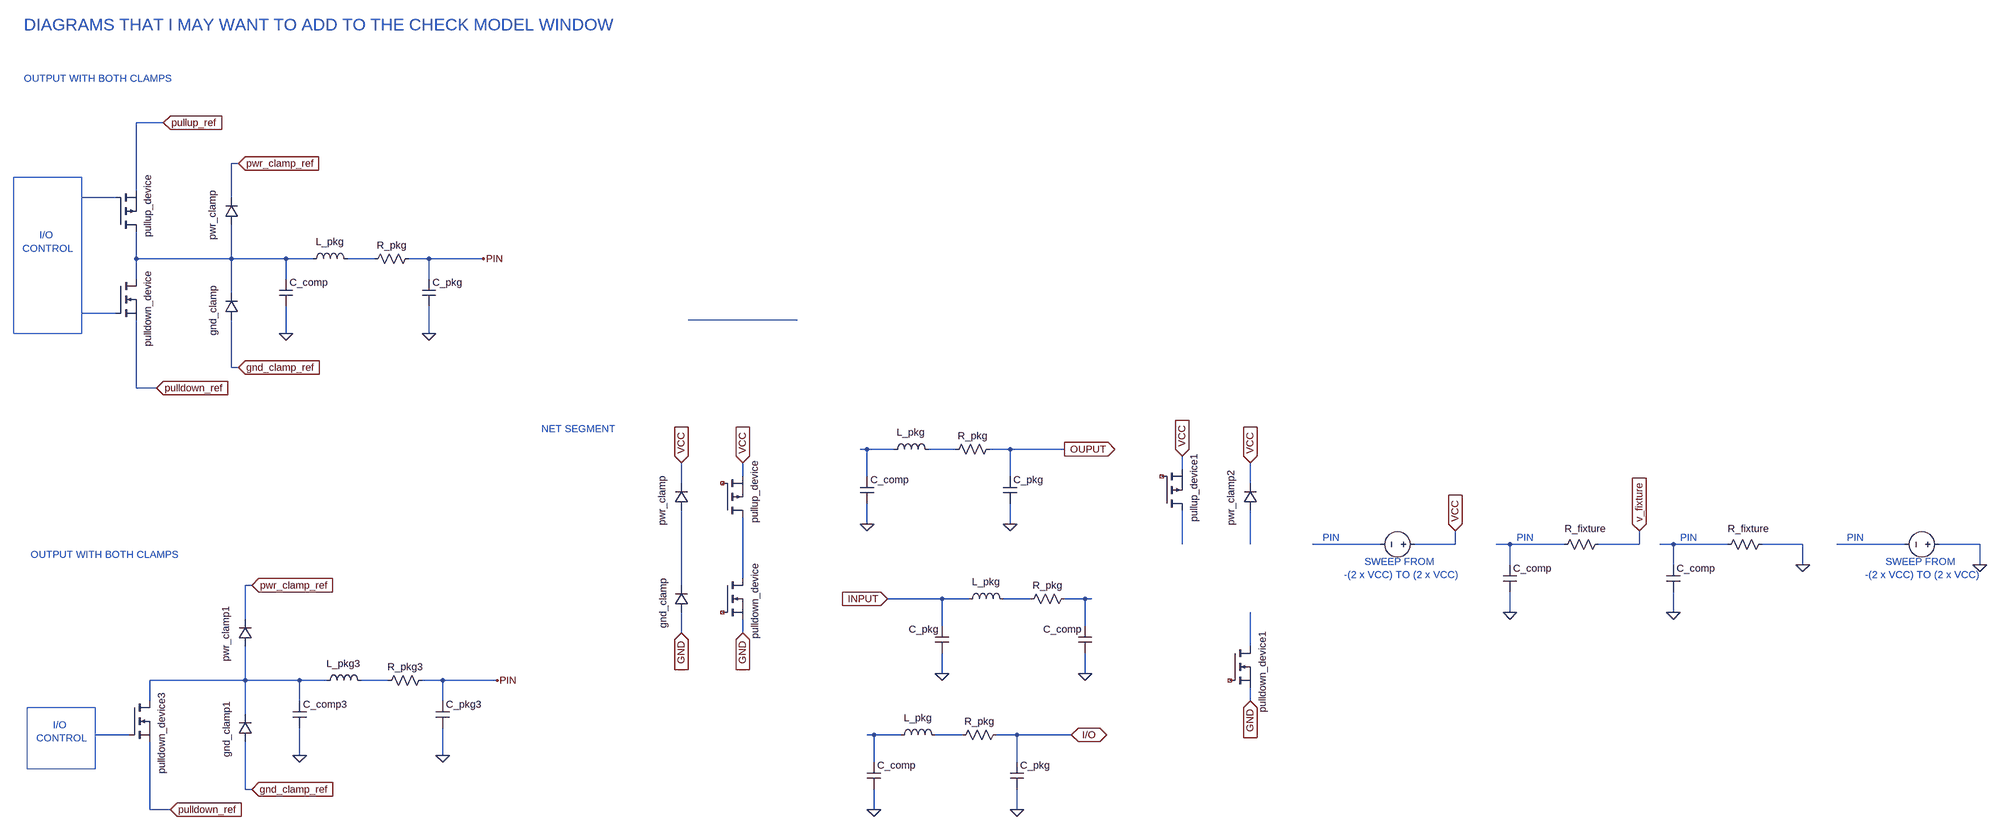
[diagram p0: schematic circuit_diagrams.asc]
circuit_diagrams.asc, the LTspice schematic file:
Version 4
SHEET 1 6020 1700
WIRE -256 -160 -320 -160
WIRE -80 -64 -96 -64
WIRE -320 0 -320 -160
WIRE -368 16 -448 16
WIRE -96 16 -96 -64
WIRE -320 160 -320 96
WIRE -96 160 -96 80
WIRE -96 160 -320 160
WIRE 32 160 -96 160
WIRE 96 160 32 160
WIRE 240 160 176 160
WIRE 368 160 320 160
WIRE 496 160 368 160
WIRE -320 208 -320 160
WIRE 32 208 32 160
WIRE 368 208 368 160
WIRE -96 240 -96 160
WIRE -368 288 -448 288
WIRE 2640 304 2384 304
WIRE 32 336 32 272
WIRE 368 336 368 272
WIRE -96 416 -96 304
WIRE -80 416 -96 416
WIRE -320 464 -320 304
WIRE -272 464 -320 464
WIRE 2864 608 2848 608
WIRE 2928 608 2864 608
WIRE 3072 608 3008 608
WIRE 3200 608 3152 608
WIRE 3328 608 3200 608
WIRE 3856 656 3856 624
WIRE 2512 672 2512 640
WIRE 2864 672 2864 608
WIRE 3200 672 3200 608
WIRE 2368 688 2368 640
WIRE 4016 688 4016 640
WIRE 2864 784 2864 736
WIRE 3200 784 3200 736
WIRE 3856 832 3856 752
WIRE 4016 832 4016 752
WIRE 4592 832 4432 832
WIRE 4768 832 4768 800
WIRE 4768 832 4672 832
WIRE 4896 832 4864 832
WIRE 5024 832 4896 832
WIRE 5200 832 5200 800
WIRE 5200 832 5104 832
WIRE 5280 832 5248 832
WIRE 5408 832 5280 832
WIRE 5584 832 5488 832
WIRE 5824 832 5664 832
WIRE 6000 832 5904 832
WIRE 4896 880 4896 832
WIRE 5280 880 5280 832
WIRE 5584 880 5584 832
WIRE 6000 880 6000 832
WIRE 2512 912 2512 768
WIRE -48 928 -64 928
WIRE 2368 928 2368 752
WIRE 3040 960 2912 960
WIRE 3104 960 3040 960
WIRE 3248 960 3184 960
WIRE 3376 960 3328 960
WIRE 3392 960 3376 960
WIRE 4896 992 4896 944
WIRE 5280 992 5280 944
WIRE -64 1008 -64 928
WIRE 3040 1024 3040 960
WIRE 3376 1024 3376 960
WIRE 2368 1040 2368 992
WIRE 2512 1040 2512 1008
WIRE 4016 1072 4016 992
WIRE 3040 1136 3040 1088
WIRE 3376 1136 3376 1088
WIRE -64 1152 -64 1072
WIRE -64 1152 -288 1152
WIRE 64 1152 -64 1152
WIRE 128 1152 64 1152
WIRE 272 1152 208 1152
WIRE 400 1152 352 1152
WIRE 528 1152 400 1152
WIRE -288 1200 -288 1152
WIRE 64 1200 64 1152
WIRE 400 1200 400 1152
WIRE 4016 1200 4016 1168
WIRE -64 1232 -64 1152
WIRE -336 1280 -416 1280
WIRE 2880 1280 2864 1280
WIRE 2944 1280 2880 1280
WIRE 3088 1280 3024 1280
WIRE 3216 1280 3168 1280
WIRE 3344 1280 3216 1280
WIRE -416 1328 -416 1280
WIRE 64 1328 64 1264
WIRE 400 1328 400 1264
WIRE 2880 1344 2880 1280
WIRE 3216 1344 3216 1280
WIRE -64 1408 -64 1296
WIRE -48 1408 -64 1408
WIRE -288 1456 -288 1296
WIRE -240 1456 -288 1456
WIRE 2880 1456 2880 1408
WIRE 3216 1456 3216 1408
FLAG 368 336 0
FLAG 32 336 0
FLAG 496 160 PIN
FLAG -256 -160 pullup_ref
IOPIN -256 -160 In
FLAG -272 464 pulldown_ref
IOPIN -272 464 In
FLAG -80 -64 pwr_clamp_ref
IOPIN -80 -64 In
FLAG -80 416 gnd_clamp_ref
IOPIN -80 416 In
FLAG 400 1328 0
FLAG 64 1328 0
FLAG 528 1152 PIN
FLAG -240 1456 pulldown_ref
IOPIN -240 1456 In
FLAG -48 928 pwr_clamp_ref
IOPIN -48 928 In
FLAG -48 1408 gnd_clamp_ref
IOPIN -48 1408 In
FLAG 3200 784 0
FLAG 2864 784 0
FLAG 3328 608 OUPUT
IOPIN 3328 608 Out
FLAG 3376 1136 0
FLAG 3040 1136 0
FLAG 2912 960 INPUT
IOPIN 2912 960 In
FLAG 2368 640 VCC
IOPIN 2368 640 In
FLAG 2368 1040 GND
IOPIN 2368 1040 In
FLAG 2512 640 VCC
IOPIN 2512 640 In
FLAG 2512 1040 GND
IOPIN 2512 1040 In
FLAG 3216 1456 0
FLAG 2880 1456 0
FLAG 3344 1280 I/O
IOPIN 3344 1280 BiDir
FLAG 3856 624 VCC
IOPIN 3856 624 In
FLAG 4016 1200 GND
IOPIN 4016 1200 In
FLAG 4768 800 VCC
IOPIN 4768 800 In
FLAG 4016 640 VCC
IOPIN 4016 640 In
FLAG 6000 880 0
FLAG 5200 800 v_fixture
IOPIN 5200 800 In
FLAG 5584 880 0
FLAG 4896 992 0
FLAG 5280 992 0
SYMBOL ind 80 176 R270
WINDOW 0 40 55 VTop 2
WINDOW 3 5 56 VBottom 2
SYMATTR InstName L_pkg
SYMATTR Value ""
SYMBOL res 336 144 R90
WINDOW 0 0 56 VBottom 2
WINDOW 3 32 56 VTop 2
SYMATTR InstName R_pkg
SYMATTR Value ""
SYMBOL cap 352 208 R0
SYMATTR InstName C_pkg
SYMATTR Value ""
SYMBOL cap 16 208 R0
SYMATTR InstName C_comp
SYMATTR Value ""
SYMBOL diode -80 80 R180
WINDOW 0 61 -36 VRight 2
WINDOW 3 24 0 Left 2
SYMATTR InstName pwr_clamp
SYMATTR Value ""
SYMBOL diode -80 304 R180
WINDOW 0 59 -37 VRight 2
WINDOW 3 24 0 Left 2
SYMATTR InstName gnd_clamp
SYMATTR Value ""
SYMBOL nmos -368 208 R0
WINDOW 0 76 -20 VRight 2
SYMATTR InstName pulldown_device
SYMATTR Value ""
SYMBOL pmos -368 96 M180
WINDOW 0 76 134 VLeft 2
SYMATTR InstName pullup_device
SYMATTR Value ""
SYMBOL ind 112 1168 R270
WINDOW 0 40 55 VTop 2
WINDOW 3 5 56 VBottom 2
SYMATTR InstName L_pkg3
SYMATTR Value ""
SYMBOL res 368 1136 R90
WINDOW 0 0 56 VBottom 2
WINDOW 3 32 56 VTop 2
SYMATTR InstName R_pkg3
SYMATTR Value ""
SYMBOL cap 384 1200 R0
SYMATTR InstName C_pkg3
SYMATTR Value ""
SYMBOL cap 48 1200 R0
SYMATTR InstName C_comp3
SYMATTR Value ""
SYMBOL diode -48 1072 R180
WINDOW 0 61 -36 VRight 2
WINDOW 3 24 0 Left 2
SYMATTR InstName pwr_clamp1
SYMATTR Value ""
SYMBOL diode -48 1296 R180
WINDOW 0 59 -37 VRight 2
WINDOW 3 24 0 Left 2
SYMATTR InstName gnd_clamp1
SYMATTR Value ""
SYMBOL nmos -336 1200 R0
WINDOW 0 76 -20 VRight 2
SYMATTR InstName pulldown_device3
SYMATTR Value ""
SYMBOL ind 2912 624 R270
WINDOW 0 40 55 VTop 2
WINDOW 3 5 56 VBottom 2
SYMATTR InstName L_pkg
SYMATTR Value ""
SYMBOL res 3168 592 R90
WINDOW 0 0 56 VBottom 2
WINDOW 3 32 56 VTop 2
SYMATTR InstName R_pkg
SYMATTR Value ""
SYMBOL cap 3184 672 R0
SYMATTR InstName C_pkg
SYMATTR Value ""
SYMBOL cap 2848 672 R0
SYMATTR InstName C_comp
SYMATTR Value ""
SYMBOL ind 3088 976 R270
WINDOW 0 40 55 VTop 2
WINDOW 3 5 56 VBottom 2
SYMATTR InstName L_pkg
SYMATTR Value ""
SYMBOL res 3344 944 R90
WINDOW 0 0 56 VBottom 2
WINDOW 3 32 56 VTop 2
SYMATTR InstName R_pkg
SYMATTR Value ""
SYMBOL cap 3056 1024 M0
SYMATTR InstName C_pkg
SYMATTR Value ""
SYMBOL cap 3392 1024 M0
SYMATTR InstName C_comp
SYMATTR Value ""
SYMBOL diode 2384 752 R180
WINDOW 0 61 -36 VRight 2
WINDOW 3 24 0 Left 2
SYMATTR InstName pwr_clamp
SYMATTR Value ""
SYMBOL diode 2384 992 R180
WINDOW 0 59 -37 VRight 2
WINDOW 3 24 0 Left 2
SYMATTR InstName gnd_clamp
SYMATTR Value ""
SYMBOL nmos 2464 912 R0
WINDOW 0 77 -36 VRight 2
SYMATTR InstName pulldown_device
SYMATTR Value ""
SYMBOL pmos 2464 768 M180
WINDOW 0 76 134 VLeft 2
SYMATTR InstName pullup_device
SYMATTR Value ""
SYMBOL ind 2928 1296 R270
WINDOW 0 40 55 VTop 2
WINDOW 3 5 56 VBottom 2
SYMATTR InstName L_pkg
SYMATTR Value ""
SYMBOL res 3184 1264 R90
WINDOW 0 0 56 VBottom 2
WINDOW 3 32 56 VTop 2
SYMATTR InstName R_pkg
SYMATTR Value ""
SYMBOL cap 3200 1344 R0
SYMATTR InstName C_pkg
SYMATTR Value ""
SYMBOL cap 2864 1344 R0
SYMATTR InstName C_comp
SYMATTR Value ""
SYMBOL pmos 3808 752 M180
WINDOW 0 76 134 VLeft 2
SYMATTR InstName pullup_device1
SYMATTR Value ""
SYMBOL nmos 3968 1072 R0
WINDOW 0 77 -36 VRight 2
SYMATTR InstName pulldown_device1
SYMATTR Value ""
SYMBOL voltage 4688 832 R90
WINDOW 0 -32 56 Invisible 2
WINDOW 3 32 56 Invisible 2
SYMATTR InstName V1
SYMBOL diode 4032 752 R180
WINDOW 0 61 -36 VRight 2
WINDOW 3 24 0 Left 2
SYMATTR InstName pwr_clamp2
SYMATTR Value ""
SYMBOL voltage 5920 832 R90
WINDOW 0 -32 56 Invisible 2
WINDOW 3 32 56 Invisible 2
SYMATTR InstName V2
SYMBOL res 5120 816 R90
WINDOW 0 -21 -1 VRight 2
WINDOW 3 32 56 Invisible 2
SYMATTR InstName R_fixture
SYMBOL cap 4880 880 R0
SYMATTR InstName C_comp
SYMATTR Value ""
SYMBOL res 5504 816 R90
WINDOW 0 -21 -1 VRight 2
WINDOW 3 32 56 Invisible 2
SYMATTR InstName R_fixture
SYMBOL cap 5264 880 R0
SYMATTR InstName C_comp
SYMATTR Value ""
TEXT -528 120 Center 2 ;I/O \nCONTROL
TEXT -584 -264 Left 2 ;OUTPUT WITH BOTH CLAMPS
TEXT -496 1272 Center 2 ;I/O \nCONTROL
TEXT -568 856 Left 2 ;OUTPUT WITH BOTH CLAMPS
TEXT -584 -504 Left 4 ;DIAGRAMS THAT I MAY WANT TO ADD TO THE CHECK MODEL WINDOW
TEXT 632 560 Left 2 ;NET SEGMENT
TEXT 4640 888 Center 2 ;SWEEP FROM \n-(2 x VCC) TO (2 x VCC)
TEXT 5864 888 Center 2 ;SWEEP FROM \n-(2 x VCC) TO (2 x VCC)
TEXT 5688 816 Left 2 ;PIN
TEXT 5296 816 Left 2 ;PIN
TEXT 4912 816 Left 2 ;PIN
TEXT 4456 816 Left 2 ;PIN
RECTANGLE Normal -448 336 -608 -32
RECTANGLE Normal -416 1360 -576 1216

The netlist it stands for:
* circuit_diagrams.asc
L_pkg N002 N003
R_pkg PIN N003
C_pkg PIN 0
C_comp N002 0
D§pwr_clamp N002 pwr_clamp_ref
D§gnd_clamp gnd_clamp_ref N002
M§pulldown_device N002 N004 pulldown_ref pulldown_ref
M§pullup_device N002 N001 pullup_ref pullup_ref
L_pkg3 N019 N020
R_pkg3 PIN N020
C_pkg3 PIN 0
C_comp3 N019 0
D§pwr_clamp1 N019 pwr_clamp_ref
D§gnd_clamp1 gnd_clamp_ref N019
M§pulldown_device3 N019 N021 pulldown_ref pulldown_ref
L_pkg N006 N007
R_pkg OUPUT N007
C_pkg OUPUT 0
C_comp N006 0
L_pkg INPUT N016
R_pkg N017 N016
C_pkg INPUT 0
C_comp N017 0
D§pwr_clamp N015 VCC
D§gnd_clamp GND N015
M§pulldown_device N014 NC_01 GND GND
M§pullup_device N014 NC_02 VCC VCC
L_pkg N022 N023
R_pkg I/O N023
C_pkg I/O 0
C_comp N022 0
M§pullup_device1 N008 NC_03 VCC VCC
M§pulldown_device1 N018 NC_04 GND GND
V1 VCC N010 V
D§pwr_clamp2 N009 VCC
V2 0 N013 V
R_fixture v_fixture N011 R
C_comp N011 0
R_fixture 0 N012 R
C_comp N012 0
.model D D
.lib standard.dio
.model NMOS NMOS
.model PMOS PMOS
.lib standard.mos
* I/O
* CONTROL
* OUTPUT WITH BOTH CLAMPS
* I/O
* CONTROL
* OUTPUT WITH BOTH CLAMPS
* DIAGRAMS THAT I MAY WANT TO ADD TO THE CHECK MODEL WINDOW
* NET SEGMENT
* SWEEP FROM
* -(2 x VCC) TO (2 x VCC)
* SWEEP FROM
* -(2 x VCC) TO (2 x VCC)
* PIN
* PIN
* PIN
* PIN
.backanno
.end